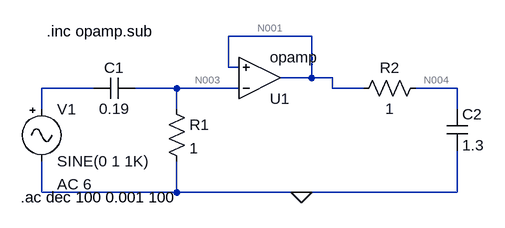
[diagram p0: schematic TS5-Ej3.asc]
TS5-Ej3.asc, the LTspice schematic file:
Version 4
SHEET 1 988 680
WIRE 416 -16 288 -16
WIRE 288 32 288 -16
WIRE 304 32 288 32
WIRE 416 48 416 -16
WIRE 416 48 368 48
WIRE 448 48 416 48
WIRE 80 64 0 64
WIRE 208 64 144 64
WIRE 304 64 208 64
WIRE 448 64 448 48
WIRE 496 64 448 64
WIRE 640 64 576 64
WIRE 0 96 0 64
WIRE 208 96 208 64
WIRE 640 96 640 64
WIRE 0 224 0 176
WIRE 208 224 208 176
WIRE 208 224 0 224
WIRE 400 224 208 224
WIRE 640 224 640 160
WIRE 640 224 400 224
FLAG 400 224 0
SYMBOL cap 144 48 R90
WINDOW 0 0 32 VBottom 2
WINDOW 3 32 32 VTop 2
SYMATTR InstName C1
SYMATTR Value 0.19
SYMBOL res 192 80 R0
SYMATTR InstName R1
SYMATTR Value 1
SYMBOL OpAmps\\opamp 336 112 M180
SYMATTR InstName U1
SYMBOL res 592 48 R90
WINDOW 0 0 56 VBottom 2
WINDOW 3 32 56 VTop 2
SYMATTR InstName R2
SYMATTR Value 1
SYMBOL cap 624 96 R0
SYMATTR InstName C2
SYMATTR Value 1.3
SYMBOL Misc\\signal 0 80 R0
WINDOW 123 24 132 Left 2
WINDOW 39 0 0 Left 0
SYMATTR Value2 AC 6
SYMATTR InstName V1
TEXT 8 -24 Left 2 !.inc opamp.sub
TEXT -32 232 Left 2 !.ac dec 100 0.001 100

The netlist it stands for:
* TS5-Ej3.asc
C1 N003 N002 0.19
R1 N003 0 1
XU1 N003 N001 N001 opamp Aol=100K GBW=10Meg  ; pins invin noninvin out
R2 N004 N001 1
C2 N004 0 1.3
V1 N002 0 SINE(0 1 1K) AC 6
.inc opamp.sub
.ac dec 100 0.001 100
.backanno
.end

* Results of the author's LTspice run, read from the files saved beside the schematic
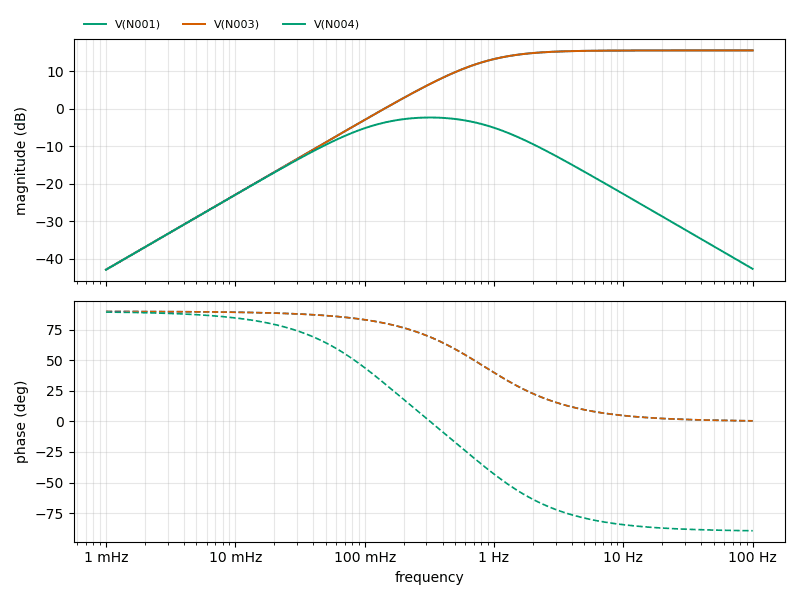
[diagram p1: AC Analysis of TS5-Ej3.asc, plotted from the saved traces]
* AC Analysis, 1 run:
*   V(N001): -42.85 dB at 1 mHz, 15.61 dB at 100 Hz, peak 15.61 dB at 100 Hz, 3 dB below the peak at 837.6 mHz
*   V(N003): -42.85 dB at 1 mHz, 15.61 dB at 100 Hz, peak 15.61 dB at 100 Hz, 3 dB below the peak at 837.6 mHz
*   V(N004): -42.85 dB at 1 mHz, -42.63 dB at 100 Hz, peak -2.28 dB at 323.6 mHz, 3 dB below the peak at 97.01 mHz and 1.057 Hz